# Altium schematic sheet kursov.SchDoc
size A3; SheetNumber: 1; SheetTotal: 1
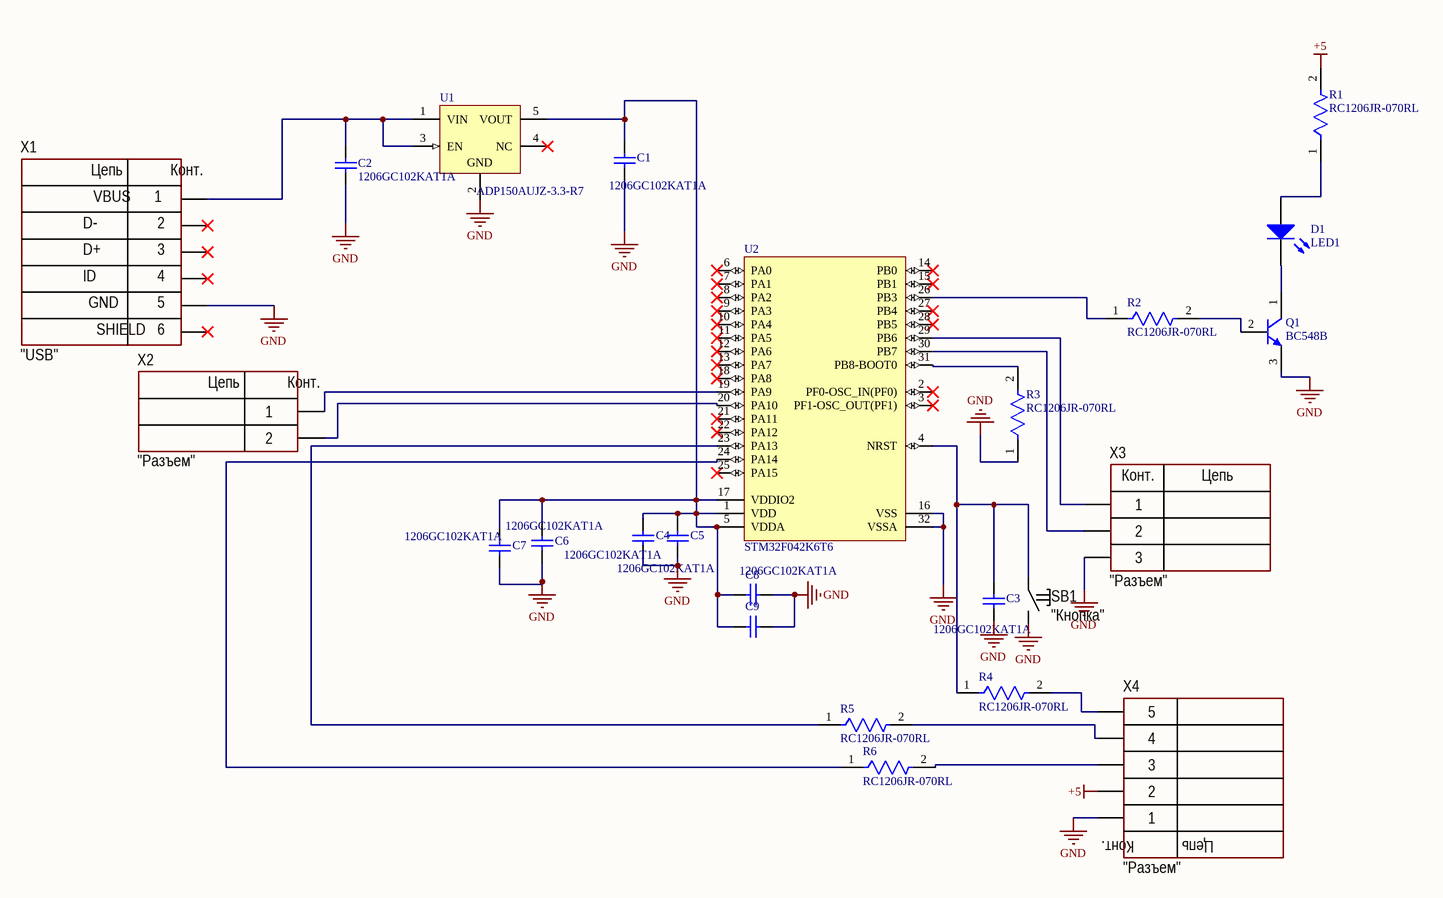
[diagram p0: kursov.SchDoc]

## Parts
C1  1206GC102KAT1A  [AVX-1206-2_L]
C2  1206GC102KAT1A  [AVX-1206-2_L]
C3  1206GC102KAT1A  [AVX-1206-2_L]
C4  1206GC102KAT1A  [AVX-1206-2_L]
C5  1206GC102KAT1A  [AVX-1206-2_L]
C6  1206GC102KAT1A  [AVX-1206-2_L]
C7  1206GC102KAT1A  [AVX-1206-2_L]
C8  1206GC102KAT1A  [AVX-1206-2_L]
C9  (no value)  [AVX-1206-2_L]
D1  LED1  [LED5MM_GRN]
Q1  BC548B  [ONSC-TO-92-3-29-11]
R1  RC1206JR-070RL  [FP-RC1206-MFG]
R2  RC1206JR-070RL  [FP-RC1206-MFG]
R3  RC1206JR-070RL  [FP-RC1206-MFG]
R4  RC1206JR-070RL  [FP-RC1206-MFG]
R5  RC1206JR-070RL  [FP-RC1206-MFG]
R6  RC1206JR-070RL  [FP-RC1206-MFG]
SB1  CommentText: "Кнопка"  [BUT: 6x6]
U1  ADP150AUJZ-3.3-R7  [ADI-UJ-5_M]
U2  STM32F042K6T6  [STM-LQFP32_M]
X1  CommentText: "USB"  [CON: USB micro-A (ZX62-B-5PA)]
X2  CommentText: "Разъем"  [CON: PLS-2]
X3  CommentText: "Разъем"  [CON: PLS-3]
X4  CommentText: "Разъем"  [CON: PLS-5]

## Nets
+5: R1.2 X4.2
GND: C1.1 C2.1 C3.1 C4.1 C5.1 C6.1 C7.1 C8.2 C9.2 Q1.3(E) R3.1 SB1.2 U1.2(GND) U2.16(VSS) U2.32(VSSA) X1.5 X3.3 X4.1
NetC1_2: C1.2 C4.2 C5.2 C6.2 C7.2 C8.1 C9.1 U1.5(VOUT) U2.1(VDD) U2.5(VDDA) U2.17(VDDIO2)
NetC2_2: C2.2 U1.1(VIN) U1.3(EN) X1.1
NetC3_2: C3.2 R4.1 SB1.1 U2.4(NRST)
NetD1_1: D1.1(A) R1.1
NetD1_2: D1.2(K) Q1.1(C)
NetQ1_2: Q1.2(B) R2.2
NetR2_1: R2.1 U2.26(PB3)
NetR3_2: R3.2 U2.31(PB8-BOOT0)
NetR4_2: R4.2 X4.5
NetR5_1: R5.1 U2.23(PA13)
NetR5_2: R5.2 X4.4
NetR6_1: R6.1 U2.24(PA14)
NetR6_2: R6.2 X4.3
NetU2_19: U2.19(PA9) X2.1
NetU2_20: U2.20(PA10) X2.2
NetU2_29: U2.29(PB6) X3.1
NetU2_30: U2.30(PB7) X3.2

Not connected (* = marked no-connect by the designer): U1 4(NC)*; U2 2(PF0-OSC_IN(PF0))* 3(PF1-OSC_OUT(PF1))* 6(PA0)* 7(PA1)* 8(PA2)* 9(PA3)* 10(PA4)* 11(PA5)* 12(PA6)* 13(PA7)* 14(PB0)* 15(PB1)* 18(PA8)* 21(PA11)* 22(PA12)* 25(PA15)* 27(PB4)* 28(PB5)*; X1 0* 2* 3* 4*

## Notes on the sheet
- (in symbol Connector_USB_micro_B) Цепь; Конт.; VBUS; D-; D+; ID; GND; SHIELD; 6
- (in symbol PLS-2) Цепь; Конт.
- (in symbol PLS-3) Конт.; Цепь
- (in symbol PLS-5) Конт.; Цепь

## Library data of the parts
C1-C8 = CMP-2000-05468-1: Chip Capacitor, 1 nF, +/- 10%, -55 to 125 degC, 1206 (3216 Metric), RoHS, Tape and Reel; Manufacturer: AVX; Capacitance: 0.001uF; Dielectric: X7R; Voltage Rating DC: 2000V; Package Reference: 1206; Datasheet Version: 11/2010; Mounting Technology: SurfaceMount; Manufacturer URL: http://www.avx.com/; Tolerance: 10%; Tolerance (%): ±10%; PartNumber: 1206GC102KAT1A; Datasheet URL: https://datasheet.ciiva.com/11787/0900766b80ed4c37-11787781.pdf; Package Description: 2-Pin SMD, Body 3.4 x 1.8 mm; Case Size/Dimension: 1206; Rated Voltage: 2000V
C9 = CMP-2000-05468-1: Chip Capacitor, 1 nF, +/- 10%, -55 to 125 degC, 1206 (3216 Metric), RoHS, Tape and Reel; PartNumber: 1206GC102KAT1A; Manufacturer: AVX; Capacitance: 0.001uF; Dielectric: X7R; Voltage Rating DC: 2000V; Package Reference: 1206; Datasheet Version: 11/2010; Mounting Technology: SurfaceMount; Manufacturer URL: http://www.avx.com/; Tolerance: 10%; Tolerance (%): ±10%; Datasheet URL: https://datasheet.ciiva.com/11787/0900766b80ed4c37-11787781.pdf; Package Description: 2-Pin SMD, Body 3.4 x 1.8 mm; Case Size/Dimension: 1206; Rated Voltage: 2000V
D1 = LED1: Typical RED GaAs LED; Published: 8-Jun-2000; LatestRevisionDate: 08-Jul-2005; LatestRevisionNote: Mech Layer 1 removed.; PackageReference: LED-1; Publisher: Altium Limited; PackageDescription: LED; 2 Leads
Q1 = CMP-1048-01456-1: Amplifier Transistor, NPN Silicon, 3-Pin TO-92, Bulk Box; Manufacturer: On Semiconductor; IC Continuous (A): 0.1; fT Min (MHz): 150; Mounting Technology: Through Hole; ComponentLink3Description: Package Specification; Polarity: NPN; ComponentLink3URL: http://www.onsemi.cn/pub_link/Collateral/2N6426-D.PDF; PartNumber: BC548B; ComponentLink2Description: Datasheet; ComponentLink1Description: Manufacturer URL; ComponentLink2URL: http://www.onsemi.com/pub_link/Collateral/BC546-D.PDF; PackageReference: TO-92-3-29-11_AM_SL; DatasheetVersion: Rev. 7; PackageDescription: 3-Pin Transistor Outline, Body 4.825 x 3.685 mm, Pitch 1.27 mm; PackageVersion: Rev. AM; Packing: Bulk Box; RoHS: FALSE; ComponentLink1URL: http://www.onsemi.com/
R1-R6 = CMP-2100-03681-2: RES SMD 0 OHM JUMPER 1/4W 1206; Manufacturer: YAGEO; Voltage Rating: 200V; Temperature Coefficient: 300ppm/°C; Power Rating: 0.25W; Value: 0Ω; Tolerance: 5%; Manufacturer Part Number: RC1206JR-070RL; Temperature Range Low: -55°C; Category: Res; Automotive: No; Ipc Land Pattern Name: RESC310160X55; Device Class L1: Passive Components; Temperature: -55°C to +155°C; ComponentLink2URL: https://www.yageo.com/upload/media/product/productsearch/datasheet/rchip/PYu-RC_Group_51_RoHS_L_10.pdf; Lead Free: Yes; Height: 0.65mm; Footprint Url: https://www.yageo.com/upload/website/yageo_PYu-R_Mount_10_19050818_343.pdf; Package: RC1206; Digikey Description: RES SMD 0 OHM JUMPER 1/4W 1206; Temperature Range High: +155°C; Device Class L3: Chip SMD Resistors; Device Class L2: Resistors; Octopart: https://octopart.com/rc1206jr-070rl-yageo-40025601; Resistance: 0Ω; Series: RC; ComponentLink2Description: Datasheet; Composition: Thick Film; RoHS: TRUE; Mouser Description: Resistor: thick film; SMD; 1206; 0O; 0.25W; ±5%; -55÷155°C
SB1 = Button_tactile: Manufacturer: TE Connectivity; ValueManufacturerPartNumber: Tactile button, 6x6mm; PartNumber: FSM2JSMAATR; TypeButton: Tactile button; HelpURL: https://www.digikey.com/product-detail/en/te-connectivity-alcoswitch-switches/FSM2JSMAATR/450-1792-1-ND/3503931; Package: 6x6mm
U1 = CMP-0786-00394-1: Ultralow Noise, 150 mA CMOS Linear Regulator, 2.2 to 5.5 V Vin, 3.3 V Vout, Industrial, 5-pin SOT23 (UJ-5), Reel; Manufacturer: Analog Devices; Supply Current IGND @ Small Load: 10uA; Vin (min) (V): 2.2; Iout max: 150mA; Preset Vout Values (V): 3.3; Vin (max) (V): 5.5; ComponentLink2Description: Datasheet; PackageReference: UJ-5; DatasheetVersion: Rev. A; PackageDescription: 5-Pin Thin Small Outline Transistor Package, Body 2.9 x 1.6 mm, Pitch 0.95 mm; ComponentLink4URL: Product URL:http://www.analog.com/en/ADP150/productSearch.html; Packing: Reel; ComponentLink1URL: http://www.analog.com/en/index.html; PartNumber: ADP150AUJZ-3.3-R7; PackageVersion: 100708-A, 10/2008; ComponentLink3Description: Package Specification; ComponentLink3URL: http:/www.analog.com/static/imported-files/packages/PKG_PDF/TSOT(UJ)/UJ_5.pdf; ComponentLink4Description: URL Link1; ComponentLink2URL: http://www.analog.com/static/imported-files/data_sheets/ADP150.pdf; Code_JEDEC: MO-193-AB; Mounting Technology: Surface Mount; ComponentLink1Description: Manufacturer URL
U2 = CMP-0304-00114-2: ARM Cortex-M0 32-bit MCU, 32 KB Flash, 6 KB Internal RAM, 28 I/Os, 32-Pin LQFP, -40 to 85 degC, Tray; Manufacturer: STMicroelectronics; Operating Frequency(F) (Processor speed) (MHz): 48; Internal RAM Size (kB): 6; Supply Voltage(Vcc) min (V): 2; I/Os (High Current): 28; FLASH Size (Prog) (kB): 32; ComponentLink1Description: Manufacturer URL; Package Reference: LQFP32; ComponentLink2Description: Datasheet; ComponentLink1URL: http://www.st.com/; Core: ARM Cortex-M0; DatasheetVersion: Rev. 5; ComponentLink2URL: http://www.st.com/st-web-ui/static/active/en/resource/technical/document/datasheet/DM00105814.pdf; Packing: Tray; Package Description: 32-Pin Low Profile Quad Flat Package, 7 x 7 mm Body, 0.8 mm Pitch; PartNumber: STM32F042K6T6; Mounting Technology: Surface Mount
X1 = Connector_USB_micro_B: Manufacturer: Hirose Electric; ValueManufacturerPartNumber: USB micro B; PartNumber: ZX62-B-5PA; HelpURL: https://www.digikey.com/product-detail/en/hirose-electric-co-ltd/ZX62-B-5PA/H11579CT-ND/1851090; TypeConnector: USB micro B
X2 = PLS-2: Manufacturer: Connfly; ValueManufacturerPartNumber: Connector, 2pin, 2.54mm, 500VAC, 3A; TypeConnector: Connector; VoltageMax: 500VAC; Pitch: 2.54mm; CurrentMax: 3A; Multichannel: 2pin; HelpURL: https://www.chipdip.ru/product/pls-2; PartNumber: PLS-2
X3 = PLS-3: Manufacturer: Connfly; ValueManufacturerPartNumber: Connector, 3pin, 2.54mm, 500VAC, 3A; TypeConnector: Connector; VoltageMax: 500VAC; Pitch: 2.54mm; CurrentMax: 3A; Multichannel: 3pin; HelpURL: https://www.chipdip.ru/product/pls-3; PartNumber: PLS-3
X4 = PLS-5: Manufacturer: Connfly; ValueManufacturerPartNumber: Connector, 5pin, 2.54mm, 500VAC, 3A; TypeConnector: Connector; VoltageMax: 500VAC; Pitch: 2.54mm; CurrentMax: 3A; Multichannel: 5pin; HelpURL: https://www.chipdip.ru/product/pls-5; PartNumber: PLS-5